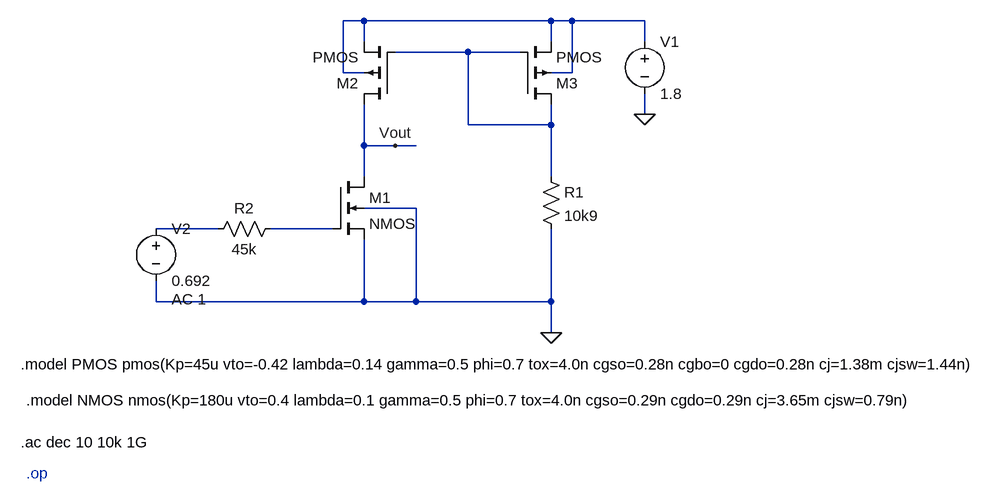
[diagram p0: schematic group_ex1.asc]
group_ex1.asc, the LTspice schematic file:
Version 4.1
SHEET 1 1120 680
WIRE 16 -64 -16 -64
WIRE 304 -64 16 -64
WIRE 336 -64 304 -64
WIRE 448 -64 336 -64
WIRE 16 -32 16 -64
WIRE 304 -32 304 -64
WIRE 448 -32 448 -64
WIRE 176 -16 64 -16
WIRE 256 -16 176 -16
WIRE -16 16 -16 -64
WIRE 16 16 -16 16
WIRE 336 16 336 -64
WIRE 336 16 304 16
WIRE 448 80 448 48
WIRE 176 96 176 -16
WIRE 304 96 304 64
WIRE 304 96 176 96
WIRE 16 128 16 64
WIRE 64 128 16 128
WIRE 96 128 64 128
WIRE 16 176 16 128
WIRE 304 176 304 96
WIRE 96 224 16 224
WIRE -208 256 -304 256
WIRE -32 256 -128 256
WIRE -304 368 -304 336
WIRE 16 368 16 272
WIRE 16 368 -304 368
WIRE 96 368 96 224
WIRE 96 368 16 368
WIRE 304 368 304 256
WIRE 304 368 96 368
WIRE 304 416 304 368
FLAG 304 416 0
FLAG 448 80 0
FLAG 64 128 Vout
SYMBOL nmos4 -32 176 R0
SYMATTR InstName M1
SYMATTR Value2 l=1u w=12.35u ad=6.2p as=6.2p pd=13.4u ps=13.4u
SYMBOL res 288 160 R0
SYMATTR InstName R1
SYMATTR Value 10k9
SYMBOL res -112 240 R90
WINDOW 0 0 56 VBottom 2
WINDOW 3 32 56 VTop 2
SYMATTR InstName R2
SYMATTR Value 45k
SYMBOL voltage 448 -48 R0
WINDOW 123 0 0 Left 0
WINDOW 39 0 0 Left 0
SYMATTR InstName V1
SYMATTR Value 1.8
SYMBOL pmos4 64 64 R180
SYMATTR InstName M2
SYMATTR Value2 l=1u w=49.4u ad=24.6p as=24.6p pd=50.4u ps=50.4u
SYMBOL voltage -304 240 R0
WINDOW 123 24 124 Left 2
WINDOW 39 0 0 Left 0
SYMATTR Value2 AC 1
SYMATTR InstName V2
SYMATTR Value 0.692
SYMBOL pmos4 256 64 M180
SYMATTR InstName M3
SYMATTR Value2 l=1u w=49.4u ad=24.6p as=24.6p pd=50.4u ps=50.4u
TEXT -512 464 Left 2 !.model PMOS pmos(Kp=45u vto=-0.42 lambda=0.14 gamma=0.5 phi=0.7 tox=4.0n cgso=0.28n cgbo=0 cgdo=0.28n cj=1.38m cjsw=1.44n)
TEXT -504 520 Left 2 !.model NMOS nmos(Kp=180u vto=0.4 lambda=0.1 gamma=0.5 phi=0.7 tox=4.0n cgso=0.29n cgdo=0.29n cj=3.65m cjsw=0.79n)
TEXT -512 584 Left 2 !.ac dec 10 10k 1G
TEXT -504 632 Left 2 ;.op

The netlist it stands for:
* group_ex1.asc
M1 Vout N004 0 0 NMOS l=1u w=12.35u ad=6.2p as=6.2p pd=13.4u ps=13.4u
R1 N002 0 10k9
R2 N004 N003 45k
V1 N001 0 1.8
M2 Vout N002 N001 N001 PMOS l=1u w=49.4u ad=24.6p as=24.6p pd=50.4u ps=50.4u
V2 N003 0 0.692 AC 1
M3 N002 N002 N001 N001 PMOS l=1u w=49.4u ad=24.6p as=24.6p pd=50.4u ps=50.4u
.model NMOS NMOS
.model PMOS PMOS
.lib standard.mos
.model PMOS pmos(Kp=45u vto=-0.42 lambda=0.14 gamma=0.5 phi=0.7 tox=4.0n cgso=0.28n cgbo=0 cgdo=0.28n cj=1.38m cjsw=1.44n)
.model NMOS nmos(Kp=180u vto=0.4 lambda=0.1 gamma=0.5 phi=0.7 tox=4.0n cgso=0.29n cgdo=0.29n cj=3.65m cjsw=0.79n)
.ac dec 10 10k 1G
* .op
.backanno
.end